# Altium project USB_FPGA_SLM_v2.PrjPcb
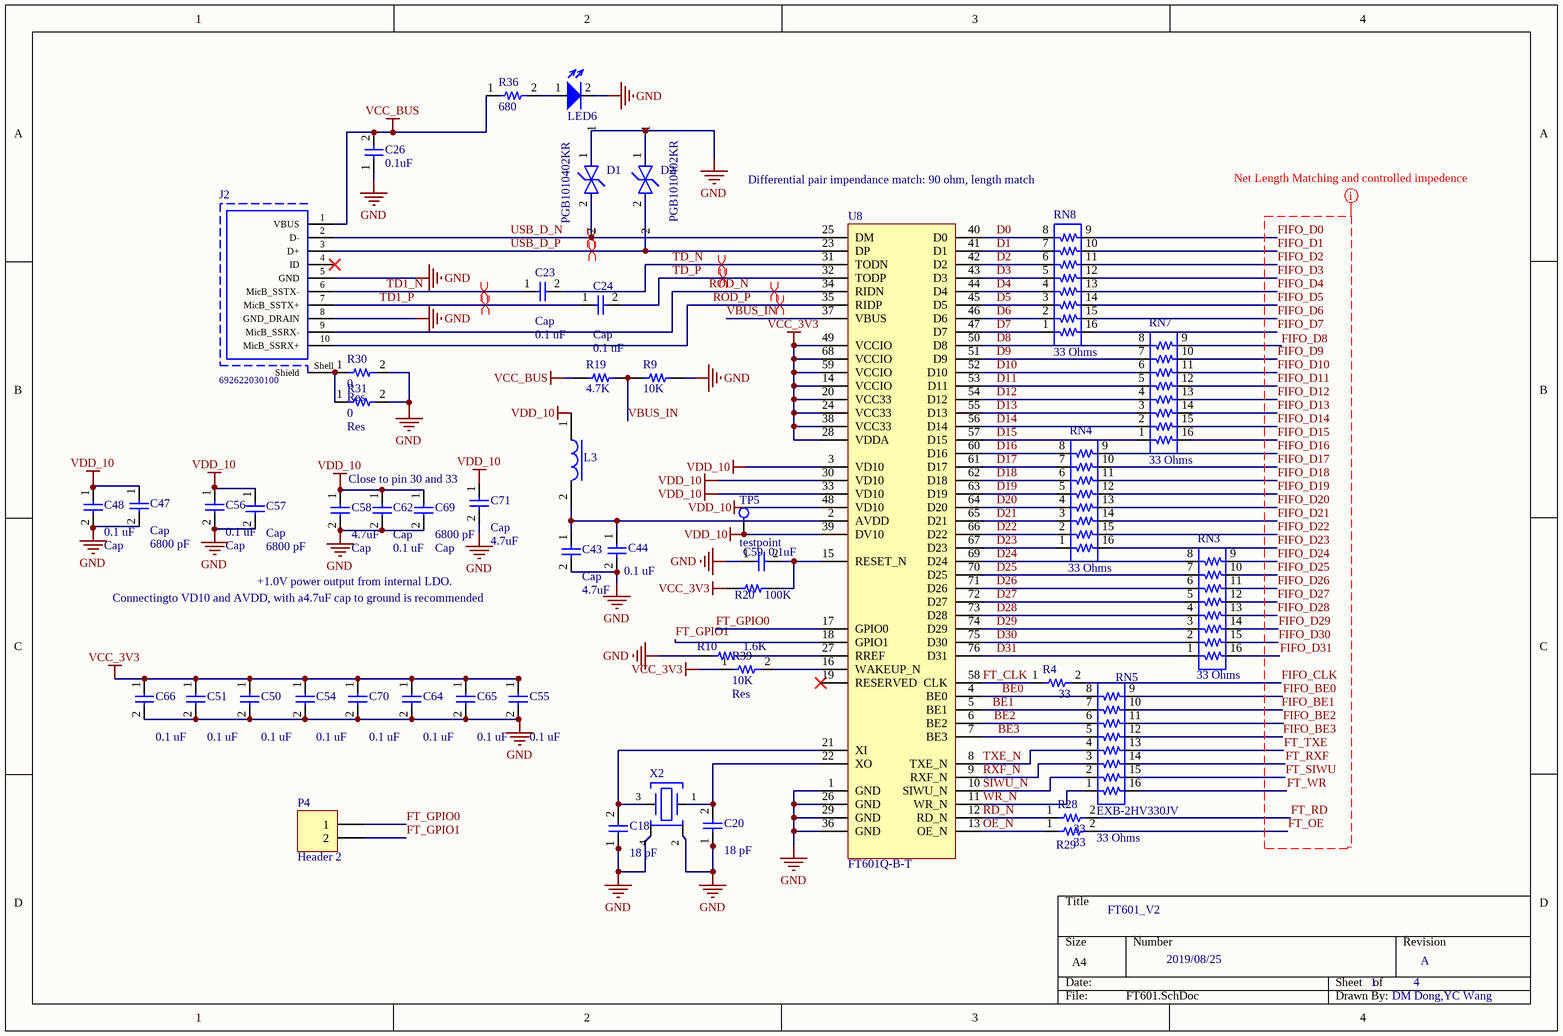
[diagram p0: FT601.SchDoc]
=Title: FPGA
2 sheets, 73 parts. Net scope: global (net labels, ports and power ports of the same name join across sheets).
Board file: PCB_Rev1.1.PcbDoc
Sheets:
  FT601.SchDoc
  FPGA_SLM.SchDoc

## Sheet FT601.SchDoc: FT601_V2
size A4; Date: 2019/08/25; CheckedBy: A Kadis; Author: DM Dong,YC Wang; CompanyName: CMMPE; DrawnBy: Daoming Dong, Youchao Wang; Revision: A; SheetNumber: 1; SheetTotal: 4

### Parts
C18  value 18 pF  [CAP_18pF_0603]  (hidden comment: C0603C180K5RACAUTO)
C20  value 18 pF  [CAP_18pF_0603]  (hidden comment: C0603C180K5RACAUTO)
C23  value 0.1 uF  Component Name: Cap  [Cap_0.1uF_0402]  (hidden comment: CC0402KPX5R6BB104)
C24  value 0.1 uF  Component Name: Cap  [Cap_0.1uF_0402]  (hidden comment: CC0402KPX5R6BB104)
C26  value 0.1uF  [Cap_0.1uF]  (hidden comment: AC0603KRX7R9BB104)
C43  value 4.7uF  Component Name: Cap  [CAP_4.7uF_0402]  (hidden comment: C1005X5R0J475K050BC)
C44  value 0.1 uF  [Cap_0.1uF_0402]  (hidden comment: CC0402KPX5R6BB104)
C47  value 6800 pF  Component Name: Cap  [CAP_6700pF_0402]  (hidden comment: C0402C682K5RECAUTO)
C48  value 0.1 uF  Component Name: Cap  [Cap_0.1uF_0402]  (hidden comment: CC0402KPX5R6BB104)
C50  value 0.1 uF  [Cap_0.1uF_0402]  (hidden comment: CC0402KPX5R6BB104)
C51  value 0.1 uF  [Cap_0.1uF_0402]  (hidden comment: CC0402KPX5R6BB104)
C54  value 0.1 uF  [Cap_0.1uF_0402]  (hidden comment: CC0402KPX5R6BB104)
C55  value 0.1 uF  [Cap_0.1uF_0402]  (hidden comment: CC0402KPX5R6BB104)
C56  value 0.1 uF  Component Name: Cap  [Cap_0.1uF_0402]  (hidden comment: CC0402KPX5R6BB104)
C57  value 6800 pF  Component Name: Cap  [CAP_6700pF_0402]  (hidden comment: C0402C682K5RECAUTO)
C58  value 4.7uF  Component Name: Cap  [CAP_4.7uF_0402]  (hidden comment: C1005X5R0J475K050BC)
C59  value 0.1uF  [Cap_0.1uF]  (hidden comment: AC0603KRX7R9BB104)
C62  value 0.1 uF  Component Name: Cap  [Cap_0.1uF_0402]  (hidden comment: CC0402KPX5R6BB104)
C64  value 0.1 uF  [Cap_0.1uF_0402]  (hidden comment: CC0402KPX5R6BB104)
C65  value 0.1 uF  [Cap_0.1uF_0402]  (hidden comment: CC0402KPX5R6BB104)
C66  value 0.1 uF  [Cap_0.1uF_0402]  (hidden comment: CC0402KPX5R6BB104)
C69  value 6800 pF  Component Name: Cap  [CAP_6700pF_0402]  (hidden comment: C0402C682K5RECAUTO)
C70  value 0.1 uF  [Cap_0.1uF_0402]  (hidden comment: CC0402KPX5R6BB104)
C71  value 4.7uF  Component Name: Cap  [CAP_4.7uF_0402]  (hidden comment: C1005X5R0J475K050BC)
D1  PGB1010402KR  [ESD_Suppressor]
D2  PGB1010402KR  [ESD_Suppressor]
J2  692622030100  [692622030100]
L3  BLM18PG300SZ1D  [FerriteBeads]  (value not drawn)
LED6  TLMS1000-GS08  [LED_RED]  (value not drawn)
P4  Header 2  [HDR1X2]
R4  value 33  [Res_33_0402]  (hidden comment: ERJ2RKD33R0X)
R9  value 10K  [RES_10K]  (hidden comment: RT0603WRE0710KL)
R10  value 1.6K  [RES_1.6K]  (hidden comment: ERJ-3RBD1601V)
R19  value 4.7K  [RES_4.7K]  (hidden comment: AC0603JR-134K7L)
R20  value 100K  [RES_100K]  (hidden comment: SR0603KR-07100KL)
R28  value 33  [Res_33_0402]  (hidden comment: ERJ2RKD33R0X)
R29  value 33  [Res_33_0402]  (hidden comment: ERJ2RKD33R0X)
R30  value 0  Component Name: Res  [RES_0]  (hidden comment: CRCW06030000Z0EAC)
R31  value 0  Component Name: Res  [RES_0]  (hidden comment: CRCW06030000Z0EAC)
R36  value 680  [RES_680]  (hidden comment: RT0603FRE13680RL)
R39  value 10K  Component Name: Res  [RES_10K]  (hidden comment: RT0603WRE0710KL)
RN3  value 33 Ohms  [ResArray_0]  (hidden comment: EXB-2HV330JV)
RN4  value 33 Ohms  [ResArray_0]  (hidden comment: EXB-2HV330JV)
RN5  EXB-2HV330JV  value 33 Ohms  [ResArray_0]
RN7  value 33 Ohms  [ResArray_0]  (hidden comment: EXB-2HV330JV)
RN8  value 33 Ohms  [ResArray_0]  (hidden comment: EXB-2HV330JV)
TP5  testpoint  [testpoint]
U8  FT601Q-B-T  [FT601_NoGND_Pad]
X2  ABM8G-30.000MHZ-18-D2Y-T  [30MHzOscillatorV2]  (value not drawn)

### Nets
GND: C18.1 C20.1 C26.1 C43.2 C44.2 C47.2 C48.2 C50.2 C51.2 C54.2 C55.2 C56.2 C57.2 C58.2 C59.1 C62.2 C64.2 C65.2 C66.2 C69.2 C70.2 C71.2 D1.1 D2.1 J2.5(GND) J2.8(GND_DRAIN) LED6.2(Cathode) R9.1 R10.1 R30.2 R31.2 U8.1(GND) U8.26(GND) U8.29(GND) U8.36(GND) X2.2(GND) X2.4(GND)
VCC_3V3: C50.1 C51.1 C54.1 C55.1 C64.1 C65.1 C66.1 C70.1 R20.1 R39.1 U8.14(VCCIO) U8.20(VCC33) U8.24(VCC33) U8.28(VDDA) U8.38(VCC33) U8.49(VCCIO) U8.59(VCCIO) U8.68(VCCIO)
VCC_BUS: C26.2 J2.1(VBUS) R19.2 R36.1
VDD_10: C47.1 C48.1 C56.1 C57.1 C58.1 C62.1 C69.1 C71.1 L3.1 TP5.1 U8.3(VD10) U8.30(VD10) U8.33(VD10) U8.39(DV10) U8.48(VD10)
BE0: RN5.8 U8.4(BE0)
BE1: RN5.7 U8.5(BE1)
BE2: RN5.6 U8.6(BE2)
BE3: RN5.5 U8.7(BE3)
D0: RN8.8 U8.40(D0)
D1: RN8.7 U8.41(D1)
D2: RN8.6 U8.42(D2)
D3: RN8.5 U8.43(D3)
D4: RN8.4 U8.44(D4)
D5: RN8.3 U8.45(D5)
D6: RN8.2 U8.46(D6)
D7: RN8.1 U8.47(D7)
D8: RN7.8 U8.50(D8)
D9: RN7.7 U8.51(D9)
D10: RN7.6 U8.52(D10)
D11: RN7.5 U8.53(D11)
D12: RN7.4 U8.54(D12)
D13: RN7.3 U8.55(D13)
D14: RN7.2 U8.56(D14)
D15: RN7.1 U8.57(D15)
D16: RN4.8 U8.60(D16)
D17: RN4.7 U8.61(D17)
D18: RN4.6 U8.62(D18)
D19: RN4.5 U8.63(D19)
D20: RN4.4 U8.64(D20)
D21: RN4.3 U8.65(D21)
D22: RN4.2 U8.66(D22)
D23: RN4.1 U8.67(D23)
D24: RN3.8 U8.69(D24)
D25: RN3.7 U8.70(D25)
D26: RN3.6 U8.71(D26)
D27: RN3.5 U8.72(D27)
D28: RN3.4 U8.73(D28)
D29: RN3.3 U8.74(D29)
D30: RN3.2 U8.75(D30)
D31: RN3.1 U8.76(D31)
FIFO_BE0: RN5.9
FIFO_BE1: RN5.10
FIFO_BE2: RN5.11
FIFO_BE3: RN5.12
FIFO_CLK: R4.2
FIFO_D0: RN8.9
FIFO_D1: RN8.10
FIFO_D2: RN8.11
FIFO_D3: RN8.12
FIFO_D4: RN8.13
FIFO_D5: RN8.14
FIFO_D6: RN8.15
FIFO_D7: RN8.16
FIFO_D8: RN7.9
FIFO_D9: RN7.10
FIFO_D10: RN7.11
FIFO_D11: RN7.12
FIFO_D12: RN7.13
FIFO_D13: RN7.14
FIFO_D14: RN7.15
FIFO_D15: RN7.16
FIFO_D16: RN4.9
FIFO_D17: RN4.10
FIFO_D18: RN4.11
FIFO_D19: RN4.12
FIFO_D20: RN4.13
FIFO_D21: RN4.14
FIFO_D22: RN4.15
FIFO_D23: RN4.16
FIFO_D24: RN3.9
FIFO_D25: RN3.10
FIFO_D26: RN3.11
FIFO_D27: RN3.12
FIFO_D28: RN3.13
FIFO_D29: RN3.14
FIFO_D30: RN3.15
FIFO_D31: RN3.16
FT_CLK: R4.1 U8.58(CLK)
FT_GPIO0: P4.1 U8.17(GPIO0)
FT_GPIO1: P4.2 U8.18(GPIO1)
FT_OE: R29.2
FT_RD: R28.2
FT_RXF: RN5.14
FT_SIWU: RN5.15
FT_TXE: RN5.13
FT_WR: RN5.16
OE_N: R29.1 U8.13(OE_N)
RD_N: R28.1 U8.12(RD_N)
ROD_N: J2.9(MicB_SSRX-) U8.34(RIDN)
ROD_P: J2.10(MicB_SSRX+) U8.35(RIDP)
RXF_N: RN5.3 U8.9(RXF_N)
SIWU_N: RN5.2 U8.10(SIWU_N)
TD1_N: C23.1 J2.6(MicB_SSTX-)
TD1_P: C24.1 J2.7(MicB_SSTX+)
TD_N: C23.2 U8.31(TODN)
TD_P: C24.2 U8.32(TODP)
TXE_N: RN5.4 U8.8(TXE_N)
USB_D_N: D1.2 J2.2(D-) U8.25(DM)
USB_D_P: D2.2 J2.3(D+) U8.23(DP)
VBUS_IN: R9.2 R19.1 U8.37(VBUS)
WR_N: RN5.1 U8.11(WR_N)
NetC18_2: C18.2 U8.21(XI) X2.3(HOT)
NetC20_2: C20.2 U8.22(XO) X2.1(HOT)
NetC43_1: C43.1 C44.1 L3.2 U8.2(AVDD)
NetC59_2: C59.2 R20.2 U8.15(RESET_N)
NetJ2_Shell: J2.Shell(Shield) R30.1 R31.1
NetLED6_1: LED6.1(Anode) R36.2
NetR10_2: R10.2 U8.27(RREF)
NetR39_2: R39.2 U8.16(WAKEUP_N)

Not connected (* = marked no-connect by the designer): J2 4(ID)*; U8 19(RESERVED)*

### Layout directives
differential pair; differential pair class Diff90: ROD_N, ROD_P, TD1_N, TD1_P, TD_N, TD_P, USB_D_N, USB_D_P
rule Matched Net Lengths [Tolerance = 24.5mm]; net class FT601FIFO: FIFO_BE0, FIFO_BE1, FIFO_BE2, FIFO_BE3, FIFO_CLK, FIFO_D0, FIFO_D1, FIFO_D2, FIFO_D3, FIFO_D4, FIFO_D5, FIFO_D6, FIFO_D7, FIFO_D8, FIFO_D9, FIFO_D10, FIFO_D11, FIFO_D12, FIFO_D13, FIFO_D14, FIFO_D15, FIFO_D16, FIFO_D17, FIFO_D18, FIFO_D19, FIFO_D20, FIFO_D21, FIFO_D22, FIFO_D23, FIFO_D24, FIFO_D25, FIFO_D26, FIFO_D27, FIFO_D28, FIFO_D29, FIFO_D30, FIFO_D31, FT_OE, FT_RD, FT_RXF, FT_SIWU, FT_TXE, FT_WR

### Notes on the sheet
- Differential pair impendance match: 90 ohm, length match
- Close to pin 30 and 33
- +1.0V power output from internal LDO.
- Connectingto VD10 and AVDD, with a4.7uF cap to ground is recommended

### Library data of the parts
C18 C20 = Cap_18pF_0603: Multilayer Ceramic Capacitors MLCC - SMD/SMT 50V 18pF 0603 X7R 10% AEC-Q200; Manufacture: KEMET; Component Name: Cap; Manufacture No.: C0603C180K5RACAUTO; Mouser No.: 80-C0603C180K5RAUTO; Case Code: 0603; Datasheet URL.: https://www.mouser.co.uk/datasheet/2/212/KEM_C1023_X7R_AUTO_SMD-1093309.pdf
C23 C24 C48 C56 C62 = CAP_0.1uF_0402: Multilayer Ceramic Capacitors MLCC - SMD/SMT 100nF 10V X5R 10%; Manufacture: Yageo; Date Created: 11-Mar-2019; Created By: Daoming Dong; Manufacture No.: CC0402KPX5R6BB104; Mouser No.: 603-CC402KPX5R6BB104; Case Code: 0402; Datasheet URL.: https://www.mouser.co.uk/datasheet/2/447/UPY-GPHC_X5R_4V-to-50V_25-1131599.pdf
C26 C59 = Cap_0.1uF: Multilayer Ceramic Capacitors MLCC - SMD/SMT 0.1uF 10% 50V AEC-Q200; Component Name: Cap; Date Created: 01-Mar-2019; Created By: Daoming Dong; Datasheet URL: https://www.mouser.co.uk/datasheet/2/447/UPY-AC_NP0X7R_16V-to-630V_11-1511105.pdf; Package: 0603; Manufacture No.: AC0603KRX7R9BB104; Mouser No.: 603-AC0603KR9BB104
C43 C58 C71 = Cap_4.7uF_0402: Multilayer Ceramic Capacitors MLCC - SMD/SMT 0402 6.3V 4.7uF X5R 10% T: 0.5mm; Manufactue: TDK; Date Created: 13-Mar-2019; Created By: Daoming Dong; Manufacture No.: C1005X5R0J475K050BC; Mouser No.: 810-C1005X5R0J475K; Case Code: 0402; Datasheet URL.: https://www.mouser.co.uk/datasheet/2/400/lcc_commercial_general_en-837201.pdf
C44 C50 C51 C54 C55 C64-C66 C70 = CAP_0.1uF_0402: Multilayer Ceramic Capacitors MLCC - SMD/SMT 100nF 10V X5R 10%; Manufacture: Yageo; Component Name: Cap; Date Created: 11-Mar-2019; Created By: Daoming Dong; Manufacture No.: CC0402KPX5R6BB104; Mouser No.: 603-CC402KPX5R6BB104; Case Code: 0402; Datasheet URL.: https://www.mouser.co.uk/datasheet/2/447/UPY-GPHC_X5R_4V-to-50V_25-1131599.pdf
C47 C57 C69 = Cap_6800pF_0402: Multilayer Ceramic Capacitors MLCC - SMD/SMT 50V 6800pF X7R 0402 10% AEC-Q200; Manufacture: KEMET; Date Created: 18-Mar-2019; Created By: Daoming Dong; Manufacture No.: C0402C682K5RECAUTO; Mouser No.: 80-C0402C682K5RECAUT; Case Code: 0402; Datasheet URL.: https://www.mouser.co.uk/datasheet/2/212/KEM_C1090_X7R_ESD-1103328.pdf
D1 D2 = ESD_Suppresor: ESD Suppressors / TVS Diodes PULSEGUARD 0402 ESD SUPPRESSOR; Manufacature: Littelfuse; Manufacture No.: PGB1010402KR; Mouser No.: 576-PGB1010402KR; Date Created: 12-Mar-2019; Created By: Daoming Dong; Component Name: ESD Suppressor; Datasheet URL.: https://www.mouser.co.uk/datasheet/2/240/Littelfuse_PulseGuard_PGB1_Datasheet.pdf-461684.pdf; Case Code: 0402
J2 = 692622030100: Micro USB 3.0 Type B Receptacle WR-COM, Horizontal, SMT, with Pads; Rated Current: 0.25 A; Contact Resistance: 50 mOhm; Working Voltage: 30 VAC; ComponentLink1Description: Manufacturer; ComponentLink1URL: http://www.we-online.de; ComponentLink2Description: Datasheet; ComponentLink2URL: https://katalog.we-online.de/em/datasheet/692622030100.pdf; Part Number: 692622030100; Published Date: September 2018; Publisher: Wurth Elektronik; Orientation: Horizontal; Connector Type: Micro USB 3.0 Type B; Operating Temperature: -20 to 85 degC; Mounting Technology: SMT; Gender: Receptacle; Packaging: Tape and Reel
L3 = FerriteBeadForFT601: Ferrite Beads 0603 30ohms 1000mA Auto Infotainment; Manufacture: muRata; Value: 30R@100MHz/1A; Component Name: Ferrite Beads; Manufacture No.: BLM18PG300SZ1D; Mouser No.: 81-BLM18PG300SZ1D; Datasheet URL.: https://www.mouser.co.uk/datasheet/2/281/c51e-794816.pdf; Created By: Daoming Dong; Data Created: 25th-Mar-2019; Case Code: 0603
LED6 = LED_RED: Standard LEDs - SMD RED; Component Name: LED_R; Vf: 1.8V; Created By: Daoming Dong; Date Created: 11-Mar-2018; Manufacture No.: TLMS1000-GS08; Mouser No.: 78-TLMS1000; Case Code: 0603; Datasheet URL.: https://www.mouser.co.uk/datasheet/2/427/tlmb1100-279843.pdf
P4 = Header 2: Header, 2-Pin; LatestRevisionDate: 17-Jul-2002; LatestRevisionNote: Re-released for DXP Platform.; Publisher: Altium Limited
R4 R28 R29 = Res_33_0402: Thick Film Resistors - SMD 0402 Resistor 0.5% 100ppm 33Ohm; Manufacture: Panasonic; Created By.: Daoming Dong; Component Name: Res; Manufcature No.: ERJ2RKD33R0X; Mouser No.: 667-ERJ-2RKD33R0X; Date Created: 12-Mar-2019; Datasheet URL.: https://www.mouser.co.uk/datasheet/2/315/AOA0000C304-1149620.pdf; Case Code: 0402
R9 = Res_10K: Thin Film Resistors - SMD 10K ohm 0.05% 50 ppm High-Precision; Manufacture: Yageo; Component Name: Res; Manufacture No.: RT0603WRE0710KL; Mouser No.: 603-RT0603WRE0710KL; Created By: Daoming Dong; Date Created: 02-Mar-2019; Datasheet URL.: https://www.mouser.co.uk/datasheet/2/447/PYu-RT_1-to-0.01_RoHS_L_9-1222720.pdf; Case Code: 0603
R10 = Res_1.6K: Thick Film Resistors - SMD 0603 Resistor 0.5% 50ppm 1.6KOhm; Manufacture: Panasonic; Component Name: Res; Created By: Daoming Dong; Date Created: 02-Mar-2019; Manufacture No.: ERJ-3RBD1601V; Mouser No.: 667-ERJ-3RBD1601V; Case Code: 0603; Datasheet URL.: https://www.mouser.co.uk/datasheet/2/315/AOA0000C304-1149620.pdf
R19 = Res_4.7K: Thick Film Resistors - SMD 4.7K ohm 5% 1/10W AEC-Q200; Manufacture: Yageo; Component Name: Res; Manufacture No.: AC0603JR-134K7L; Mouser No.: 603-AC0603JR-134K7L; Created By: Daoming Dong; Date Created: 02-Mar-2019; Case Code: 0603; Datasheet URL.: https://www.mouser.co.uk/datasheet/2/447/PYu-AC_51_RoHS_L_6-1152827.pdf
R20 = Res_100K: Thick Film Resistors - SMD 100K ohm 10% 75V AEC-Q200; Manufacture: Yageo; Component Name: Res; Manufacture No.: SR0603KR-07100KL; Mouser No.: 603-SR0603KR-07100KL; Date Created: 02-Mar-2019; Created By: Daoming Dong; Datasheet URL.: https://www.mouser.co.uk/datasheet/2/447/PYu-SR_20105_RoHS_L_7-1488668.pdf; Case Code: 0603
R30 R31 = Res_0: Thick Film Resistors - SMD 1/10Watt 0ohms Commercial Use; Manufacture: Vishay; Case Code: 0603; Manufacture No.: CRCW06030000Z0EAC; Mouser No.: 71-CRCW06030000Z0EAC; Created By: Daoming Dong; Date Created: 02-Mar-2019; Datasheet URL.: https://www.mouser.co.uk/datasheet/2/427/crcwce3-1223726.pdf
R36 = Res_680: Thin Film Resistors - SMD 680 ohm 1% 50 ppm Thin Film; Manufacture: Yageo; Component Name: Res; Manufacture No.: RT0603FRE13680RL; Mouser No.: 603-RT0603FRE13680RL; Created By: Daoming Dong; Date Created: 02-Mar-2019; Datasheet URL.: https://www.mouser.co.uk/datasheet/2/447/PYu-RT_1-to-0.01_RoHS_L_9-1222720.pdf; Case Code: 0603
R39 = Res_10K: Thin Film Resistors - SMD 10K ohm 0.05% 50 ppm High-Precision; Manufacture: Yageo; Manufacture No.: RT0603WRE0710KL; Mouser No.: 603-RT0603WRE0710KL; Created By: Daoming Dong; Date Created: 02-Mar-2019; Datasheet URL.: https://www.mouser.co.uk/datasheet/2/447/PYu-RT_1-to-0.01_RoHS_L_9-1222720.pdf; Case Code: 0603
RN3-RN5 RN7 RN8 = ResArray: Resistor Networks & Arrays 33 OHM 5%; Component Name: Resistor Array; Manufacture No.: EXB-2HV330JV; Mouser No.: 667-EXB-2HV330JV; Datasheet URL.: https://www.mouser.co.uk/datasheet/2/315/AOC0000C14-1108062.pdf; Date Created: 11-Mar-2019
TP5 = Testpoint: Testpoint for testing voltage; Created By: Daoming Dong; Date Created: 11-Mar-2019
U8 = FT601Q-B-T: USB Interface IC USB 3.0 Super-Speed 32Bits Sync FIFO; Created By: Daoming Dong; Farnell Order Code: 2748207; Manufacture Part No.: FT601Q-B-T; RS Stock No.: 146-6840; Date Created: 25th Feb 2019; Datasheet URL: http://www.farnell.com/datasheets/2263949.pdf
X2 = 30MHzOscillator: Crystals 30.000MHz 18pF 30ppm -40C +85C; Created By: Youchao Wang; Date Created: 29th Aug 2019; Manufacture No.: ABM8G-30.000MHZ-18-D2Y-T; Datasheet URL.: https://www.mouser.co.uk/datasheet/2/3/ABM8G-10572.pdf; Mouser Stock No.: 815-ABM8G-30-18D2Y; Component Name: 30MHz Oscillator

## Sheet FPGA_SLM.SchDoc: FPGA_SLM_V2
size A4; Date: 2019/08/25; CheckedBy: A Kadis; Author: DM Dong, YC Wang; CompanyName: CMMPE; DrawnBy: Daoming Dong, Youchao Wang; Revision: B; SheetNumber: 3; SheetTotal: 4
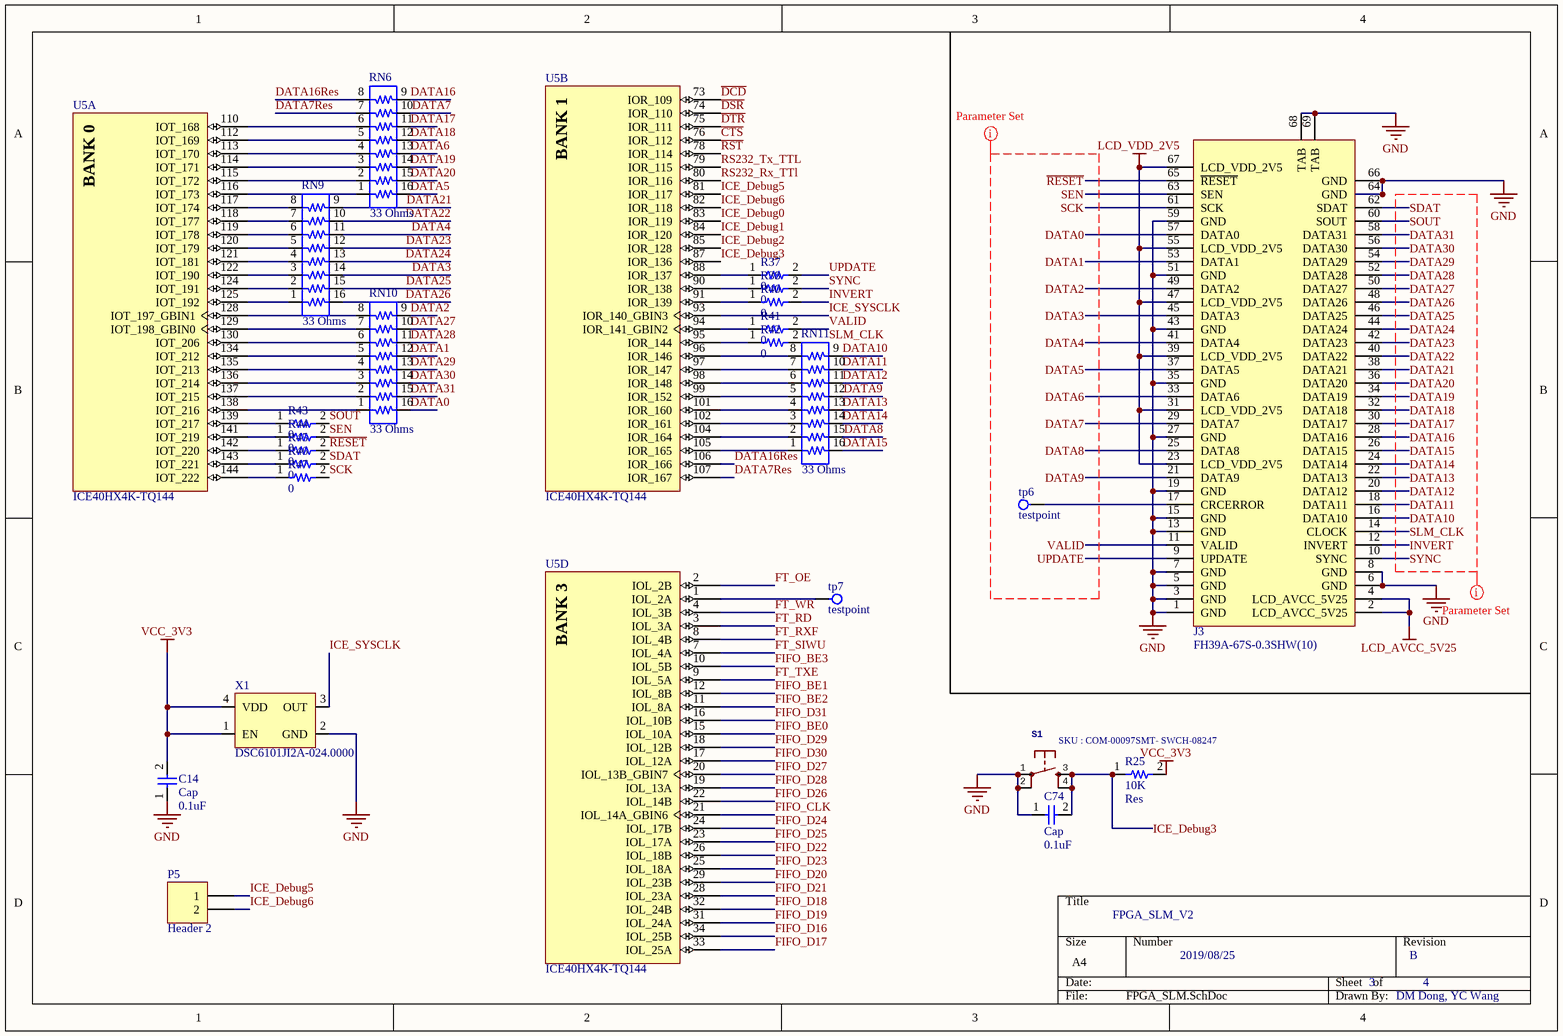
[diagram p1: FPGA_SLM.SchDoc]

### Parts
C14  value 0.1uF  Component Name: Cap  [Cap_0.1uF]  (hidden comment: AC0603KRX7R9BB104)
C74  value 0.1uF  Component Name: Cap  [Cap_0.1uF]  (hidden comment: AC0603KRX7R9BB104)
J3  FH39A-67S-0.3SHW(10)  [Hirose_connector]
P5  Header 2  [HDR1X2]
R25  value 10K  Component Name: Res  [RES_10K]  (hidden comment: RT0603WRE0710KL)
R37  value 0  [RES_0]  (hidden comment: CRCW06030000Z0EAC)
R38  value 0  [RES_0]  (hidden comment: CRCW06030000Z0EAC)
R40  value 0  [RES_0]  (hidden comment: CRCW06030000Z0EAC)
R41  value 0  [RES_0]  (hidden comment: CRCW06030000Z0EAC)
R42  value 0  [RES_0]  (hidden comment: CRCW06030000Z0EAC)
R43  value 0  [RES_0]  (hidden comment: CRCW06030000Z0EAC)
R44  value 0  [RES_0]  (hidden comment: CRCW06030000Z0EAC)
R45  value 0  [RES_0]  (hidden comment: CRCW06030000Z0EAC)
R46  value 0  [RES_0]  (hidden comment: CRCW06030000Z0EAC)
R47  value 0  [RES_0]  (hidden comment: CRCW06030000Z0EAC)
RN6  value 33 Ohms  [ResArray_0]  (hidden comment: EXB-2HV330JV)
RN9  value 33 Ohms  [ResArray_0]  (hidden comment: EXB-2HV330JV)
RN10  value 33 Ohms  [ResArray_0]  (hidden comment: EXB-2HV330JV)
RN11  value 33 Ohms  [ResArray_0]  (hidden comment: EXB-2HV330JV)
S1  SKU : COM-00097SMT- SWCH-08247  [TACTILE-PTH]
tp6  testpoint  [testpoint]
tp7  testpoint  [testpoint]
U5  ICE40HX4K-TQ144  [LATC-TQFP-144_L]  (parts A,B,D of 5)
X1  DSC6101JI2A-024.0000  [24MHzOscillator]

### Nets
GND: C14.1 C74.1 J3.1(GND) J3.3(GND) J3.5(GND) J3.6(GND) J3.7(GND) J3.8(GND) J3.13(GND) J3.15(GND) J3.19(GND) J3.27(GND) J3.35(GND) J3.43(GND) J3.51(GND) J3.59(GND) J3.64(GND) J3.66(GND) J3.68(TAB) J3.69(TAB) S1.1 S1.2 X1.2(GND)
LCD_AVCC_5V25: J3.2(LCD_AVCC_5V25) J3.4(LCD_AVCC_5V25)
LCD_VDD_2V5: J3.23(LCD_VDD_2V5) J3.31(LCD_VDD_2V5) J3.39(LCD_VDD_2V5) J3.47(LCD_VDD_2V5) J3.55(LCD_VDD_2V5) J3.67(LCD_VDD_2V5)
VCC_3V3: C14.2 R25.2 X1.1(EN) X1.4(VDD)
~{CTS}: U5.76(IOR_112)
~{DCD}: U5.73(IOR_109)
~{DSR}: U5.74(IOR_110)
~{DTR}: U5.75(IOR_111)
DATA0: J3.57(DATA0) RN10.16
DATA1: J3.53(DATA1) RN10.12
DATA2: J3.49(DATA2) RN10.9
DATA3: J3.45(DATA3) RN9.14
DATA4: J3.41(DATA4) RN9.11
DATA5: J3.37(DATA5) RN6.16
DATA6: J3.33(DATA6) RN6.13
DATA7: J3.29(DATA7) RN6.10
DATA7Res: RN6.7 U5.107(IOR_167)
DATA8: J3.25(DATA8) RN11.15
DATA9: J3.21(DATA9) RN11.12
DATA10: J3.16(DATA10) RN11.9
DATA11: J3.18(DATA11) RN11.10
DATA12: J3.20(DATA12) RN11.11
DATA13: J3.22(DATA13) RN11.13
DATA14: J3.24(DATA14) RN11.14
DATA15: J3.26(DATA15) RN11.16
DATA16: J3.28(DATA16) RN6.9
DATA16Res: RN6.8 U5.106(IOR_166)
DATA17: J3.30(DATA17) RN6.11
DATA18: J3.32(DATA18) RN6.12
DATA19: J3.34(DATA19) RN6.14
DATA20: J3.36(DATA20) RN6.15
DATA21: J3.38(DATA21) RN9.9
DATA22: J3.40(DATA22) RN9.10
DATA23: J3.42(DATA23) RN9.12
DATA24: J3.44(DATA24) RN9.13
DATA25: J3.46(DATA25) RN9.15
DATA26: J3.48(DATA26) RN9.16
DATA27: J3.50(DATA27) RN10.10
DATA28: J3.52(DATA28) RN10.11
DATA29: J3.54(DATA29) RN10.13
DATA30: J3.56(DATA30) RN10.14
DATA31: J3.58(DATA31) RN10.15
FIFO_BE0: U5.15(IOL_10A)
FIFO_BE1: U5.12(IOL_8B)
FIFO_BE2: U5.11(IOL_8A)
FIFO_BE3: U5.10(IOL_5B)
FIFO_CLK: U5.21(IOL_14A_GBIN6)
FIFO_D16: U5.34(IOL_25B)
FIFO_D17: U5.33(IOL_25A)
FIFO_D18: U5.32(IOL_24B)
FIFO_D19: U5.31(IOL_24A)
FIFO_D20: U5.29(IOL_23B)
FIFO_D21: U5.28(IOL_23A)
FIFO_D22: U5.26(IOL_18B)
FIFO_D23: U5.25(IOL_18A)
FIFO_D24: U5.24(IOL_17B)
FIFO_D25: U5.23(IOL_17A)
FIFO_D26: U5.22(IOL_14B)
FIFO_D27: U5.20(IOL_13B_GBIN7)
FIFO_D28: U5.19(IOL_13A)
FIFO_D29: U5.18(IOL_12B)
FIFO_D30: U5.17(IOL_12A)
FIFO_D31: U5.16(IOL_10B)
FT_OE: U5.2(IOL_2B)
FT_RD: U5.3(IOL_3A)
FT_RXF: U5.8(IOL_4B)
FT_SIWU: U5.7(IOL_4A)
FT_TXE: U5.9(IOL_5A)
FT_WR: U5.4(IOL_3B)
ICE_Debug0: U5.83(IOR_119)
ICE_Debug1: U5.84(IOR_120)
ICE_Debug2: U5.85(IOR_128)
ICE_Debug3: C74.2 R25.1 S1.3 S1.4 U5.87(IOR_136)
ICE_Debug5: P5.1 U5.81(IOR_117)
ICE_Debug6: P5.2 U5.82(IOR_118)
ICE_SYSCLK: U5.93(IOR_140_GBIN3) X1.3(OUT)
INVERT: J3.12(INVERT) R40.2
~{RESET}: J3.65(~{RESET}) R45.2
~{RST}: U5.78(IOR_114)
RS232_Rx_TTl: U5.80(IOR_116)
RS232_Tx_TTL: U5.79(IOR_115)
SCK: J3.61(SCK) R47.2
SDAT: J3.62(SDAT) R46.2
SEN: J3.63(SEN) R44.2
SLM_CLK: J3.14(CLOCK) R42.2
SOUT: J3.60(SOUT) R43.2
SYNC: J3.10(SYNC) R38.2
UPDATE: J3.9(UPDATE) R37.2
VALID: J3.11(VALID) R41.2
NetJ3_17: J3.17(CRCERROR) tp6.1
NetR37_1: R37.1 U5.88(IOR_137)
NetR38_1: R38.1 U5.90(IOR_138)
NetR40_1: R40.1 U5.91(IOR_139)
NetR41_1: R41.1 U5.94(IOR_141_GBIN2)
NetR42_1: R42.1 U5.95(IOR_144)
NetR43_1: R43.1 U5.139(IOT_217)
NetR44_1: R44.1 U5.141(IOT_219)
NetR45_1: R45.1 U5.142(IOT_220)
NetR46_1: R46.1 U5.143(IOT_221)
NetR47_1: R47.1 U5.144(IOT_222)
NetRN6_1: RN6.1 U5.116(IOT_173)
NetRN6_2: RN6.2 U5.115(IOT_172)
NetRN6_3: RN6.3 U5.114(IOT_171)
NetRN6_4: RN6.4 U5.113(IOT_170)
NetRN6_5: RN6.5 U5.112(IOT_169)
NetRN6_6: RN6.6 U5.110(IOT_168)
NetRN9_1: RN9.1 U5.125(IOT_192)
NetRN9_2: RN9.2 U5.124(IOT_191)
NetRN9_3: RN9.3 U5.122(IOT_190)
NetRN9_4: RN9.4 U5.121(IOT_181)
NetRN9_5: RN9.5 U5.120(IOT_179)
NetRN9_6: RN9.6 U5.119(IOT_178)
NetRN9_7: RN9.7 U5.118(IOT_177)
NetRN9_8: RN9.8 U5.117(IOT_174)
NetRN10_1: RN10.1 U5.138(IOT_216)
NetRN10_2: RN10.2 U5.137(IOT_215)
NetRN10_3: RN10.3 U5.136(IOT_214)
NetRN10_4: RN10.4 U5.135(IOT_213)
NetRN10_5: RN10.5 U5.134(IOT_212)
NetRN10_6: RN10.6 U5.130(IOT_206)
NetRN10_7: RN10.7 U5.129(IOT_198_GBIN0)
NetRN10_8: RN10.8 U5.128(IOT_197_GBIN1)
NetRN11_1: RN11.1 U5.105(IOR_165)
NetRN11_2: RN11.2 U5.104(IOR_164)
NetRN11_3: RN11.3 U5.102(IOR_161)
NetRN11_4: RN11.4 U5.101(IOR_160)
NetRN11_5: RN11.5 U5.99(IOR_152)
NetRN11_6: RN11.6 U5.98(IOR_148)
NetRN11_7: RN11.7 U5.97(IOR_147)
NetRN11_8: RN11.8 U5.96(IOR_146)
Nettp7_1: tp7.1 U5.1(IOL_2A)

### Layout directives
rule Matched Net Lengths [Tolerance = 5mm]; net class SLM: DATA0, DATA1, DATA2, DATA3, DATA4, DATA5, DATA6, DATA7, DATA8, DATA9, DATA10, DATA11, DATA12, DATA13, DATA14, DATA15, DATA16, DATA17, DATA18, DATA19, DATA20, DATA21, DATA22, DATA23, DATA24, DATA25, DATA26, DATA27, DATA28, DATA29, DATA30, DATA31, INVERT, SCK, SDAT, SEN, SLM_CLK, SOUT, SYNC, UPDATE, VALID, ~{RESET}

### Notes on the sheet
- (in symbol ICE40HX4K-TQ144, part A) BANK 0
- (in symbol ICE40HX4K-TQ144, part B) BANK 1
- (in symbol ICE40HX4K-TQ144, part D) BANK 3

### Library data of the parts
C14 C74 = Cap_0.1uF: Multilayer Ceramic Capacitors MLCC - SMD/SMT 0.1uF 10% 50V AEC-Q200; Date Created: 01-Mar-2019; Created By: Daoming Dong; Datasheet URL: https://www.mouser.co.uk/datasheet/2/447/UPY-AC_NP0X7R_16V-to-630V_11-1511105.pdf; Package: 0603; Manufacture No.: AC0603KRX7R9BB104; Mouser No.: 603-AC0603KR9BB104
J3 = FH39A-67S-0.3SHW(10): FFC & FPC Connectors FPC ZIF CONN 67 POS SMT HORZ MNT; Manufacture: Hirose Connector; Component Name: Hirose Connector FH39A-67S-0.3SHW(10); Manufacture No.: FH39A-67S-0.3SHW(10); Mouser No.: 798-FH39A-67S-0.3SHW(10); Created By: Daoming Dong; Date Created: 05-Mar-2019; Datasheet URL.: https://www.mouser.co.uk/datasheet/2/185/_catalog-939287.pdf
P5 = Header 2: Header, 2-Pin; LatestRevisionDate: 17-Jul-2002; LatestRevisionNote: Re-released for DXP Platform.; Publisher: Altium Limited
R25 = Res_10K: as R39 on sheet FT601; Manufacture No.: RT0603WRE0710KL; Mouser No.: 603-RT0603WRE0710KL; Created By: Daoming Dong; Date Created: 02-Mar-2019; Datasheet URL.: https://www.mouser.co.uk/datasheet/2/447/PYu-RT_1-to-0.01_RoHS_L_9-1222720.pdf; Case Code: 0603
R37 R38 R40-R47 = Res_0: Thick Film Resistors - SMD 1/10Watt 0ohms Commercial Use; Manufacture: Vishay; Component Name: Res; Case Code: 0603; Manufacture No.: CRCW06030000Z0EAC; Mouser No.: 71-CRCW06030000Z0EAC; Created By: Daoming Dong; Date Created: 02-Mar-2019; Datasheet URL.: https://www.mouser.co.uk/datasheet/2/427/crcwce3-1223726.pdf
RN6 RN9-RN11 = ResArray: as RN3 on sheet FT601; Manufacture No.: EXB-2HV330JV; Mouser No.: 667-EXB-2HV330JV; Date Created: 11-Mar-2019; Datasheet URL.: https://www.mouser.co.uk/datasheet/2/315/AOC0000C14-1108062.pdf
S1 = TAC_SWITCHPTH: GateName_1: S; SymbolName_1: SWITCH-MOMENTARY; DeviceName: PTH; LibraryName: SparkFun-Electromechanical; DeviceSetName: TAC_SWITCH; Package: TACTILE-PTH
tp6 tp7 = Testpoint: Testpoint for testing voltage; Created By: Daoming Dong; Date Created: 11-Mar-2019
U5 = ICE40HX4K-TQ144: iCE40 HX4K Series FPGA Family, 3520 Logic Cells, 1.2 V Core, 80 K Embedded RAM Bits, 144-pin TQFP, Pb-Free, Tray; Manufacturer: Lattice Semiconductor; Embedded RAM Bits: 80K; Logic Cells: 3520; Phase-Locked Loops: 2; Supply Voltage: 1.2V; DatasheetVersion: Rev. 02.9; PackageVersion: Rev. 03.9, 02/2013; PackageReference: TQFP-144; PackageDescription: 144-Pin Thin Quad Flat Package, Body 20 x 20 mm, Pitch 0.5 mm; Supplier 1: Digi-Key; Supplier Part Number 1: 220-1572-ND; Supplier 2: Mouser; Supplier Part Number 2: 842-ICE40HX4K-TQ144; Packing: Tray; RoHS: TRUE; Mounting Technology: Surface Mount; PartNumber: ICE40HX4K-TQ144; ComponentLink1Description: Manufacturer URL; ComponentLink1URL: http://www.latticesemi.com/en; ComponentLink2Description: Datasheet; ComponentLink2URL: http://www.latticesemi.com/~/media/Documents/DataSheets/iCE/iCE40LPHXFamilyDataSheet.pdf; ComponentLink3Description: Package Specification; ComponentLink3URL: http://www.latticesemi.com/lit/docs/package/pkg.pdf
X1 = 24MHzOscillator: Standard Clock Oscillators MEMS Oscillator, Ultra Low Power, LVCMOS, -40C-85C, 25ppm, 2.5x2.0mm; Manufacture: Microchip; Frequency: 24 MHz; Created By: Daoming Dong; Date Created: 12-Mar-2019; Manufacture No.: DSC6101JI2A-024.0000; Mouser No.: 579-C6101JI2A0240000; Frequency Stability: 25 PPM; Datasheet URL.: https://www.mouser.co.uk/datasheet/2/268/20005624B-1149202.pdf

## Nets that join several sheets
GND: FT601 (37 pins), FPGA_SLM (23 pins)
VCC_3V3: FT601 (18 pins), FPGA_SLM (C14.2 R25.2 X1.1 X1.4)
FIFO_BE0: FT601 (RN5.9), FPGA_SLM (U5.15)
FIFO_BE1: FT601 (RN5.10), FPGA_SLM (U5.12)
FIFO_BE2: FT601 (RN5.11), FPGA_SLM (U5.11)
FIFO_BE3: FT601 (RN5.12), FPGA_SLM (U5.10)
FIFO_CLK: FT601 (R4.2), FPGA_SLM (U5.21)
FIFO_D16: FT601 (RN4.9), FPGA_SLM (U5.34)
FIFO_D17: FT601 (RN4.10), FPGA_SLM (U5.33)
FIFO_D18: FT601 (RN4.11), FPGA_SLM (U5.32)
FIFO_D19: FT601 (RN4.12), FPGA_SLM (U5.31)
FIFO_D20: FT601 (RN4.13), FPGA_SLM (U5.29)
FIFO_D21: FT601 (RN4.14), FPGA_SLM (U5.28)
FIFO_D22: FT601 (RN4.15), FPGA_SLM (U5.26)
FIFO_D23: FT601 (RN4.16), FPGA_SLM (U5.25)
FIFO_D24: FT601 (RN3.9), FPGA_SLM (U5.24)
FIFO_D25: FT601 (RN3.10), FPGA_SLM (U5.23)
FIFO_D26: FT601 (RN3.11), FPGA_SLM (U5.22)
FIFO_D27: FT601 (RN3.12), FPGA_SLM (U5.20)
FIFO_D28: FT601 (RN3.13), FPGA_SLM (U5.19)
FIFO_D29: FT601 (RN3.14), FPGA_SLM (U5.18)
FIFO_D30: FT601 (RN3.15), FPGA_SLM (U5.17)
FIFO_D31: FT601 (RN3.16), FPGA_SLM (U5.16)
FT_OE: FT601 (R29.2), FPGA_SLM (U5.2)
FT_RD: FT601 (R28.2), FPGA_SLM (U5.3)
FT_RXF: FT601 (RN5.14), FPGA_SLM (U5.8)
FT_SIWU: FT601 (RN5.15), FPGA_SLM (U5.7)
FT_TXE: FT601 (RN5.13), FPGA_SLM (U5.9)
FT_WR: FT601 (RN5.16), FPGA_SLM (U5.4)